# Altium project NeoPixel (ws2812) LED Matrix - 8x8.PrjPcb
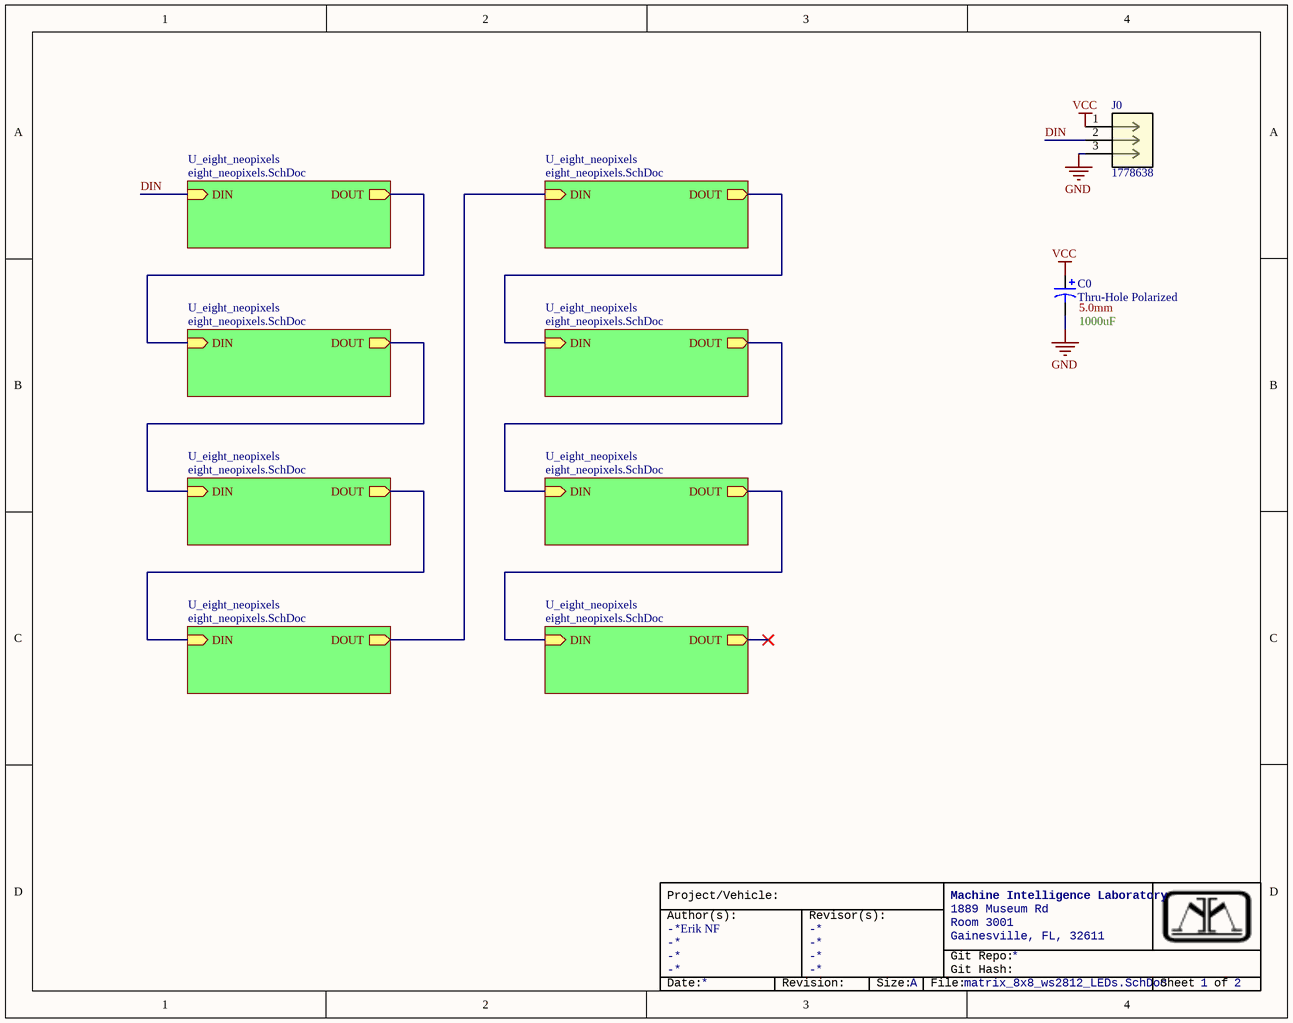
[diagram p0: matrix_8x8_ws2812_LEDs.SchDoc]
2 sheets, 130 parts. Net scope: hierarchical (ports join the sheet entries above them; power ports are global).
Board file: matrix_8x8_ws2812_LEDs.PcbDoc
Sheets:
  matrix_8x8_ws2812_LEDs.SchDoc
    U_eight_neopixels = eight_neopixels.SchDoc
    U_eight_neopixels = eight_neopixels.SchDoc
    U_eight_neopixels = eight_neopixels.SchDoc
    U_eight_neopixels = eight_neopixels.SchDoc
    U_eight_neopixels = eight_neopixels.SchDoc
    U_eight_neopixels = eight_neopixels.SchDoc
    U_eight_neopixels = eight_neopixels.SchDoc
    U_eight_neopixels = eight_neopixels.SchDoc

## Sheet matrix_8x8_ws2812_LEDs.SchDoc
size A; Organization: Machine Intelligence Laboratory; Address1: 1889 Museum Rd; Address2: Room 3001; Address3: Gainesville, FL, 32611; SheetNumber: 1; SheetTotal: 2

### Parts
C0  Thru-Hole Polarized  Pin Spacing: 5.0mm  Capacitance: 1000uF  [[Cap] Thru-Hole Polarized 3.5mm]
J0  1778638  [CONN_1814854]

### Sub-sheets
U_eight_neopixels = eight_neopixels.SchDoc: DIN (in), DOUT (out)
U_eight_neopixels = eight_neopixels.SchDoc: DIN (in), DOUT (out)
U_eight_neopixels = eight_neopixels.SchDoc: DIN (in), DOUT (out)
U_eight_neopixels = eight_neopixels.SchDoc: DIN (in), DOUT (out)
U_eight_neopixels = eight_neopixels.SchDoc: DIN (in), DOUT (out)
U_eight_neopixels = eight_neopixels.SchDoc: DIN (in), DOUT (out)
U_eight_neopixels = eight_neopixels.SchDoc: DIN (in), DOUT (out)
U_eight_neopixels = eight_neopixels.SchDoc: DIN (in), DOUT (out)

### Nets
GND: C0.2 J0.3
VCC: C0.1 J0.1
DIN: J0.2 ; sheet U_eight_neopixels/DIN
NetU0_U_eight_neopixels1_4: sheet U_eight_neopixels/DOUT, sheet U_eight_neopixels/DIN
NetU0_U_eight_neopixels2_4: sheet U_eight_neopixels/DOUT, sheet U_eight_neopixels/DIN
NetU0_U_eight_neopixels3_4: sheet U_eight_neopixels/DOUT, sheet U_eight_neopixels/DIN
NetU0_U_eight_neopixels4_4: sheet U_eight_neopixels/DOUT, sheet U_eight_neopixels/DIN
NetU0_U_eight_neopixels6_4: sheet U_eight_neopixels/DOUT, sheet U_eight_neopixels/DIN
NetU0_U_eight_neopixels7_4: sheet U_eight_neopixels/DOUT, sheet U_eight_neopixels/DIN
NetU0_U_eight_neopixels8_4: sheet U_eight_neopixels/DOUT, sheet U_eight_neopixels/DIN

### Notes on the sheet
- Erik NF
- Project/Vehicle:
- Author(s):
- -
- Revisor(s):
- Git Repo:
- Git Hash:
- Date:
- Revision:
- Size:
- A
- File:
- Sheet
- of

### Library data of the parts
C0 = [Cap] Thru-Hole Polarized: Tolerance: 20%; Voltage: 10V
J0 = 1778638: PCB headers, nominal cross section: 0.5 mmÂ², color: black, nominal current: 6 A, rated voltage (III/2): 160 V, contact surface: Tin, contact connection type: Pin, number of potentials: 3, number of rows: 1, number of positions: 3, number of connections: 3, product range: PTSM 0,5/..-HH-THR, pitch: 2.5 mm, mounting: THR soldering, pin layout: Linear pinning, solder pin [P]: 2.1 mm, number of solder pins per potential: 1, plug-in system: COMBICON PTSM, Pin connector pattern alignment: Standard, locking: without, mounting: without, type of packaging: 32 mm wide tape; Manufacturer_Name: Phoenix Contact; Copyright: Copyright (C) 2025 Ultra Librarian. All rights reserved.; Manufacturer_Part_Number: 1778638; RefDes: RefDes; Type: Type

## Sheet eight_neopixels.SchDoc
size A; SheetNumber: 2; SheetTotal: 2
Used 8 times, as channels U_eight_neopixels, U_eight_neopixels, U_eight_neopixels, U_eight_neopixels, U_eight_neopixels, U_eight_neopixels, U_eight_neopixels, U_eight_neopixels. Parts and nets are listed once, with the designators drawn on the sheet.
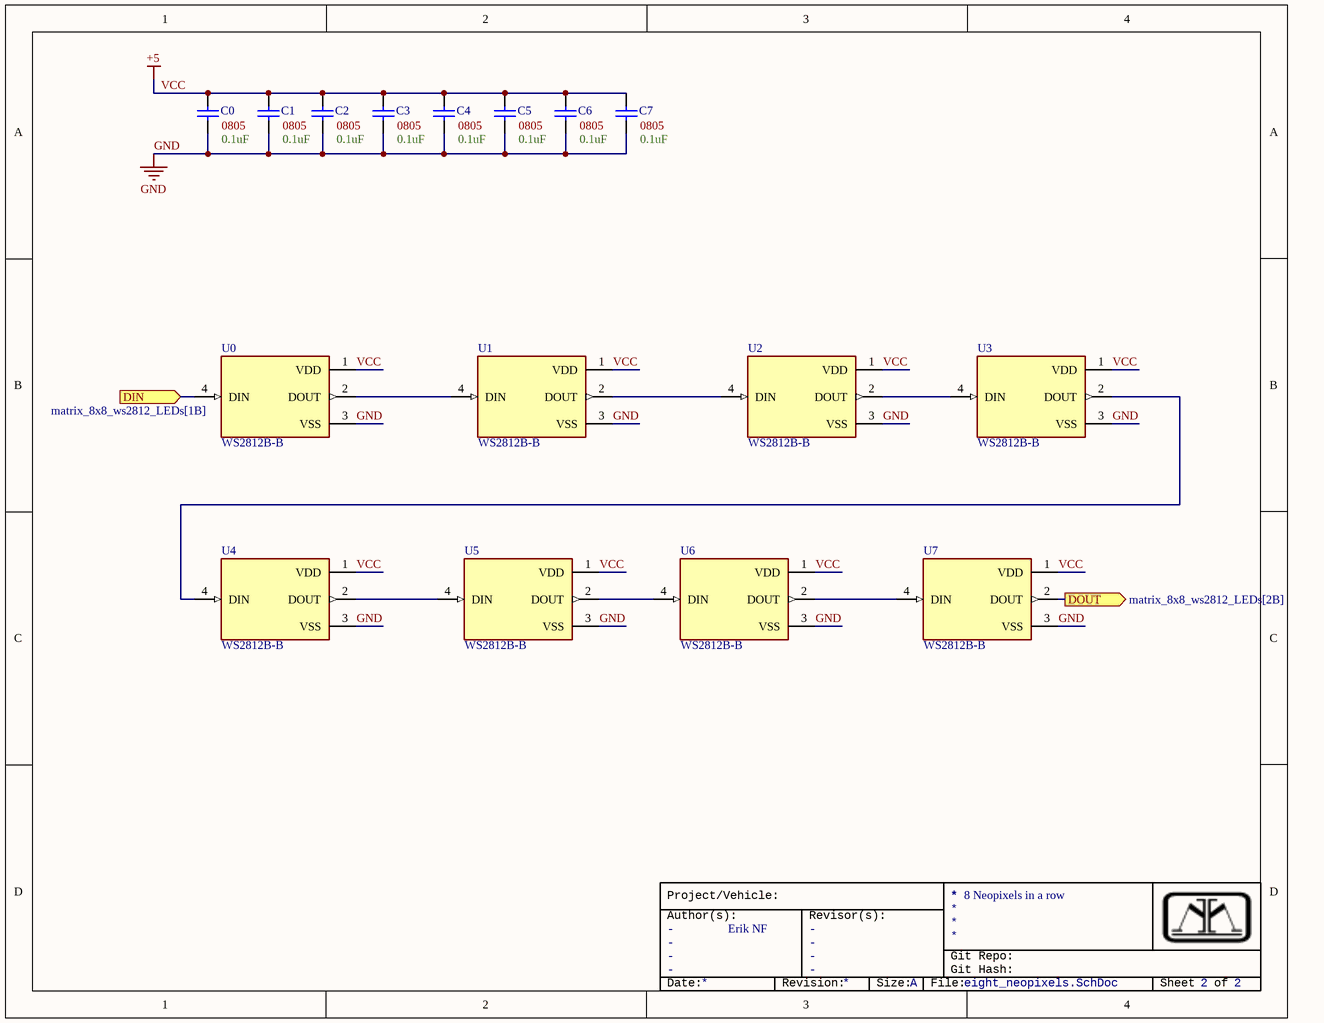
[diagram p1: eight_neopixels.SchDoc]

### Parts
C0  Size Package: 0805  Capacitance: 0.1uF  [[Cap] SMD 0805]  (hidden comment: SMD Nonpolarized)
C1  Size Package: 0805  Capacitance: 0.1uF  [[Cap] SMD 0805]  (hidden comment: SMD Nonpolarized)
C2  Size Package: 0805  Capacitance: 0.1uF  [[Cap] SMD 0805]  (hidden comment: SMD Nonpolarized)
C3  Size Package: 0805  Capacitance: 0.1uF  [[Cap] SMD 0805]  (hidden comment: SMD Nonpolarized)
C4  Size Package: 0805  Capacitance: 0.1uF  [[Cap] SMD 0805]  (hidden comment: SMD Nonpolarized)
C5  Size Package: 0805  Capacitance: 0.1uF  [[Cap] SMD 0805]  (hidden comment: SMD Nonpolarized)
C6  Size Package: 0805  Capacitance: 0.1uF  [[Cap] SMD 0805]  (hidden comment: SMD Nonpolarized)
C7  Size Package: 0805  Capacitance: 0.1uF  [[Cap] SMD 0805]  (hidden comment: SMD Nonpolarized)
U0  WS2812B-B  [LED_WS2812B-B]
U1  WS2812B-B  [LED_WS2812B-B]
U2  WS2812B-B  [LED_WS2812B-B]
U3  WS2812B-B  [LED_WS2812B-B]
U4  WS2812B-B  [LED_WS2812B-B]
U5  WS2812B-B  [LED_WS2812B-B]
U6  WS2812B-B  [LED_WS2812B-B]
U7  WS2812B-B  [LED_WS2812B-B]

### Ports
DIN (in, see matrix_8x8_ws2812_LEDs[1B]), DOUT (out, see matrix_8x8_ws2812_LEDs[2B])

### Nets
GND: C0.1 C1.1 C2.1 C3.1 C4.1 C5.1 C6.1 C7.1 U0.3(VSS) U1.3(VSS) U2.3(VSS) U3.3(VSS) U4.3(VSS) U5.3(VSS) U6.3(VSS) U7.3(VSS)
VCC: C0.2 C1.2 C2.2 C3.2 C4.2 C5.2 C6.2 C7.2 U0.1(VDD) U1.1(VDD) U2.1(VDD) U3.1(VDD) U4.1(VDD) U5.1(VDD) U6.1(VDD) U7.1(VDD)  [also labelled +5]
DIN: U0.4(DIN) ; port DIN
DOUT: U7.2(DOUT) ; port DOUT
NetU0_2: U0.2(DOUT) U1.4(DIN)
NetU1_2: U1.2(DOUT) U2.4(DIN)
NetU2_2: U2.2(DOUT) U3.4(DIN)
NetU3_2: U3.2(DOUT) U4.4(DIN)
NetU4_2: U4.2(DOUT) U5.4(DIN)
NetU5_2: U5.2(DOUT) U6.4(DIN)
NetU6_2: U6.2(DOUT) U7.4(DIN)

### Channels
U_eight_neopixels: designators end in _U_eight_neopixels5; ports DIN=DIN DOUT=NetU0_U_eight_neopixels6_4
U_eight_neopixels: designators end in _U_eight_neopixels6; ports DIN=NetU0_U_eight_neopixels6_4 DOUT=NetU0_U_eight_neopixels7_4
U_eight_neopixels: designators end in _U_eight_neopixels7; ports DIN=NetU0_U_eight_neopixels7_4 DOUT=NetU0_U_eight_neopixels8_4
U_eight_neopixels: designators end in _U_eight_neopixels8; ports DIN=NetU0_U_eight_neopixels8_4 DOUT=NetU0_U_eight_neopixels1_4
U_eight_neopixels: designators end in _U_eight_neopixels1; ports DIN=NetU0_U_eight_neopixels1_4 DOUT=NetU0_U_eight_neopixels2_4
U_eight_neopixels: designators end in _U_eight_neopixels2; ports DIN=NetU0_U_eight_neopixels2_4 DOUT=NetU0_U_eight_neopixels3_4
U_eight_neopixels: designators end in _U_eight_neopixels3; ports DIN=NetU0_U_eight_neopixels3_4 DOUT=NetU0_U_eight_neopixels4_4
U_eight_neopixels: designators end in _U_eight_neopixels4; ports DIN=NetU0_U_eight_neopixels4_4 DOUT=NetU7_U_eight_neopixels4_2

### Notes on the sheet
- 8 Neopixels in a row
- Erik NF
- Project/Vehicle:
- Author(s):
- -
- Revisor(s):
- Git Repo:
- Git Hash:
- Date:
- Revision:
- Size:
- A
- File:
- Sheet
- of

### Library data of the parts
C0-C7 = [Cap] SMD Nonpolarized: Voltage: 6.3V; Tolerance: 10%
U0-U7 = WS2812B-B: Intelligent control LED integrated light source; Availability: Unavailable; Price: None; Package: None; MP: WS2812B-B; Value: *

## Nets that join several sheets
GND: matrix_8x8_ws2812_LEDs (C0.2 J0.3), U_eight_neopixels (16 pins), U_eight_neopixels (16 pins), U_eight_neopixels (16 pins), U_eight_neopixels (16 pins), U_eight_neopixels (16 pins), U_eight_neopixels (16 pins), U_eight_neopixels (16 pins), U_eight_neopixels (16 pins)
VCC: U_eight_neopixels (16 pins), U_eight_neopixels (16 pins), U_eight_neopixels (16 pins), U_eight_neopixels (16 pins), U_eight_neopixels (16 pins), U_eight_neopixels (16 pins), U_eight_neopixels (16 pins), U_eight_neopixels (16 pins)
DIN: matrix_8x8_ws2812_LEDs (J0.2), U_eight_neopixels (U0_U_eight_neopixels5.4)
NetU0_U_eight_neopixels1_4: U_eight_neopixels (U7_U_eight_neopixels8.2), U_eight_neopixels (U0_U_eight_neopixels1.4)
NetU0_U_eight_neopixels2_4: U_eight_neopixels (U7_U_eight_neopixels1.2), U_eight_neopixels (U0_U_eight_neopixels2.4)
NetU0_U_eight_neopixels3_4: U_eight_neopixels (U7_U_eight_neopixels2.2), U_eight_neopixels (U0_U_eight_neopixels3.4)
NetU0_U_eight_neopixels4_4: U_eight_neopixels (U7_U_eight_neopixels3.2), U_eight_neopixels (U0_U_eight_neopixels4.4)
NetU0_U_eight_neopixels6_4: U_eight_neopixels (U7_U_eight_neopixels5.2), U_eight_neopixels (U0_U_eight_neopixels6.4)
NetU0_U_eight_neopixels7_4: U_eight_neopixels (U7_U_eight_neopixels6.2), U_eight_neopixels (U0_U_eight_neopixels7.4)
NetU0_U_eight_neopixels8_4: U_eight_neopixels (U7_U_eight_neopixels7.2), U_eight_neopixels (U0_U_eight_neopixels8.4)